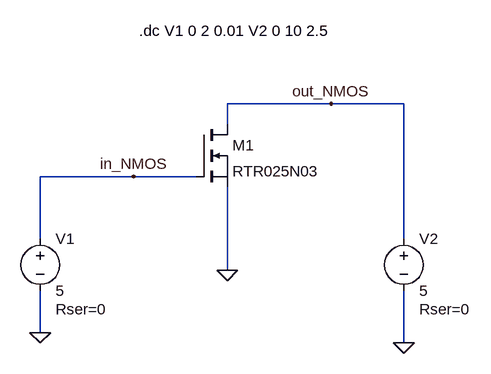
[diagram p0: schematic priklad2.asc]
priklad2.asc, the LTspice schematic file:
Version 4
SHEET 1 880 680
WIRE 400 -48 240 -48
WIRE 512 -48 400 -48
WIRE 240 -16 240 -48
WIRE 96 64 -48 64
WIRE 192 64 96 64
WIRE -48 160 -48 64
WIRE 512 160 512 -48
WIRE 240 208 240 80
WIRE -48 304 -48 240
WIRE 512 320 512 240
FLAG -48 304 0
FLAG 240 208 0
FLAG 512 320 0
FLAG 96 64 in_NMOS
FLAG 400 -48 out_NMOS
SYMBOL voltage -48 144 R0
WINDOW 123 0 0 Left 2
WINDOW 39 24 124 Left 2
SYMATTR InstName V1
SYMATTR Value 5
SYMATTR SpiceLine Rser=0
SYMBOL voltage 512 144 R0
WINDOW 123 0 0 Left 2
WINDOW 39 24 124 Left 2
SYMATTR InstName V2
SYMATTR Value 5
SYMATTR SpiceLine Rser=0
SYMBOL nmos 192 -16 R0
SYMATTR InstName M1
SYMATTR Value RTR025N03
TEXT 104 -160 Left 2 !.dc V1 0 2 0.01 V2 0 10 2.5

The netlist it stands for:
* priklad2.asc
V1 in_NMOS 0 5 Rser=0
V2 out_NMOS 0 5 Rser=0
M1 out_NMOS in_NMOS 0 0 RTR025N03
.model NMOS NMOS
.model PMOS PMOS
.lib standard.mos
.dc V1 0 2 0.01 V2 0 10 2.5
.backanno
.end